# Altium schematic sheet SolarTracker.SchDoc
size A4
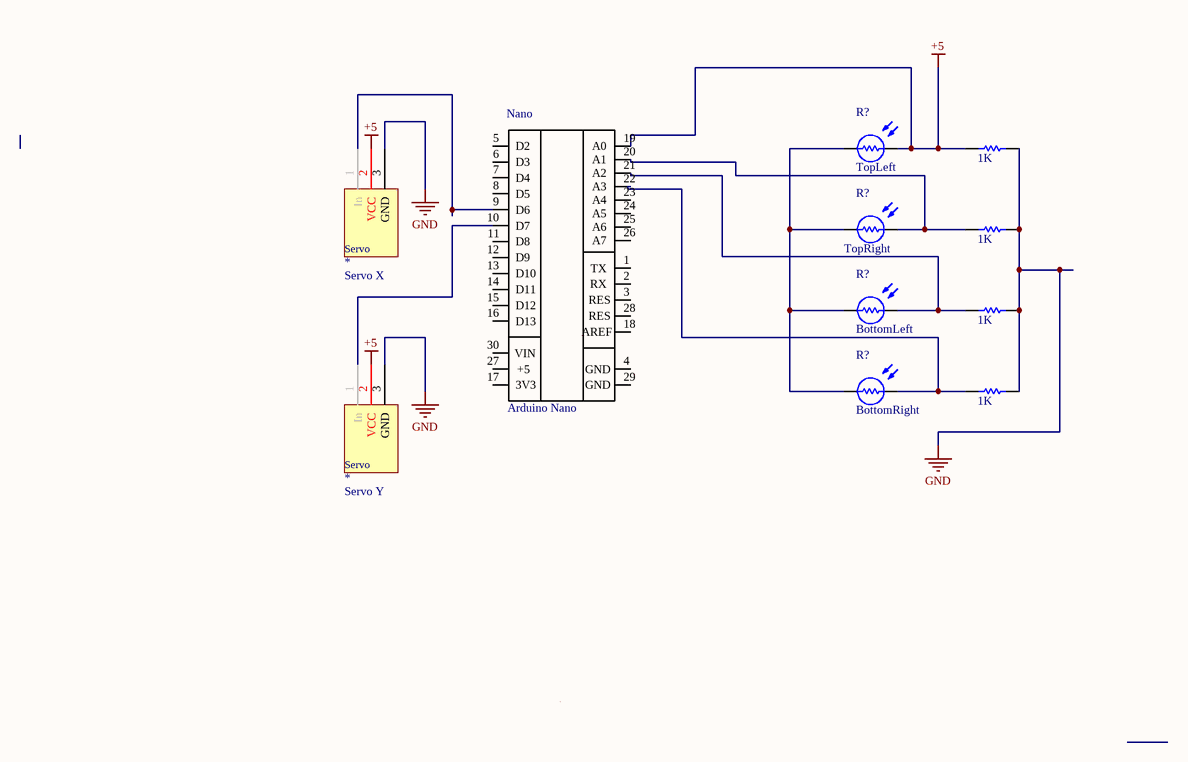
[diagram p0: SolarTracker.SchDoc]

## Parts
(Parts that share a designator on the sheet are numbered #1, #2 ... from top to bottom, then left to right.)
1K#1  Res1  [PCB-zyf25hm6kfjob49w5ym7-1]  (value not drawn)
1K#2  Res1  [PCB-zyf25hm6kfjob49w5ym7-1]  (value not drawn)
1K#3  Res1  [PCB-zyf25hm6kfjob49w5ym7-1]  (value not drawn)
1K#4  Res1  [PCB-zyf25hm6kfjob49w5ym7-1]  (value not drawn)
*#1  Servo X
*#2  Servo Y
Nano  Arduino Nano  [PCB-7wo2sjbeftl9slcus1y4-1]
R?#1  TopLeft  [PCBComponent_1]
R?#2  TopRight  [PCBComponent_1]
R?#3  BottomLeft  [PCBComponent_1]
R?#4  BottomRight  [PCBComponent_1]

## Nets
+5: 1K#1.1 *#1.2(VCC) *#2.2(VCC) Nano.19(A0) R?#1.2
GND: 1K#1.2 1K#2.2 1K#3.2 1K#4.2 *#1.3(GND) *#2.3(GND)
Net1K#2_1: 1K#2.1 Nano.20(A1) R?#2.2
Net1K#3_1: 1K#3.1 Nano.21(A2) R?#3.2
Net1K#4_1: 1K#4.1 Nano.22(A3) R?#4.2
Net*#1_1: *#1.1(In) Nano.9(D6)
Net*#2_1: *#2.1(In) Nano.10(D7)
NetR?#1_1: R?#1.1 R?#2.1 R?#3.1 R?#4.1

Not connected (* = marked no-connect by the designer): Nano 1(TX) 2(RX) 3(RES) 4(GND) 5(D2) 6(D3) 7(D4) 8(D5) 11(D8) 12(D9) 13(D10) 14(D11) 15(D12) 16(D13) 17(3V3) 18(AREF) 23(A4) 24(A5) 25(A6) 26(A7) 27(+5) 28(RES) 29(GND) 30(VIN)

## Notes on the sheet
- (in symbol 900-00005) Servo

## Library data of the parts
1K#1-1K#4 = CRM2512-FX-1001ELF: Current sense resistor [Bourns] CRM2512-FX-1001ELF Current sense resistor
*#1 *#2 = 900-00005: Keo No. 1/0 Trade, Plain, 60 Degree Included Angle, Cobalt Combin. More details: No. 1/0 Trade, Plain, 60 Degree...; Manufacturer Part Number: 900-00005; OctopartID: 9c465546e5b94381; Octopart URL: https://octopart.com/900-00005-parallax-679065; RoHS: Compliant
Nano = A000005: Nano 3.0 Atmel Atmega 328 MCU board; Core Architecture: AVR; RoHS: Compliant
R?#1-R?#4 = 161: photoresistor d=5mm